# Altium schematic sheet FLIR LWIR.SchDoc
size A2
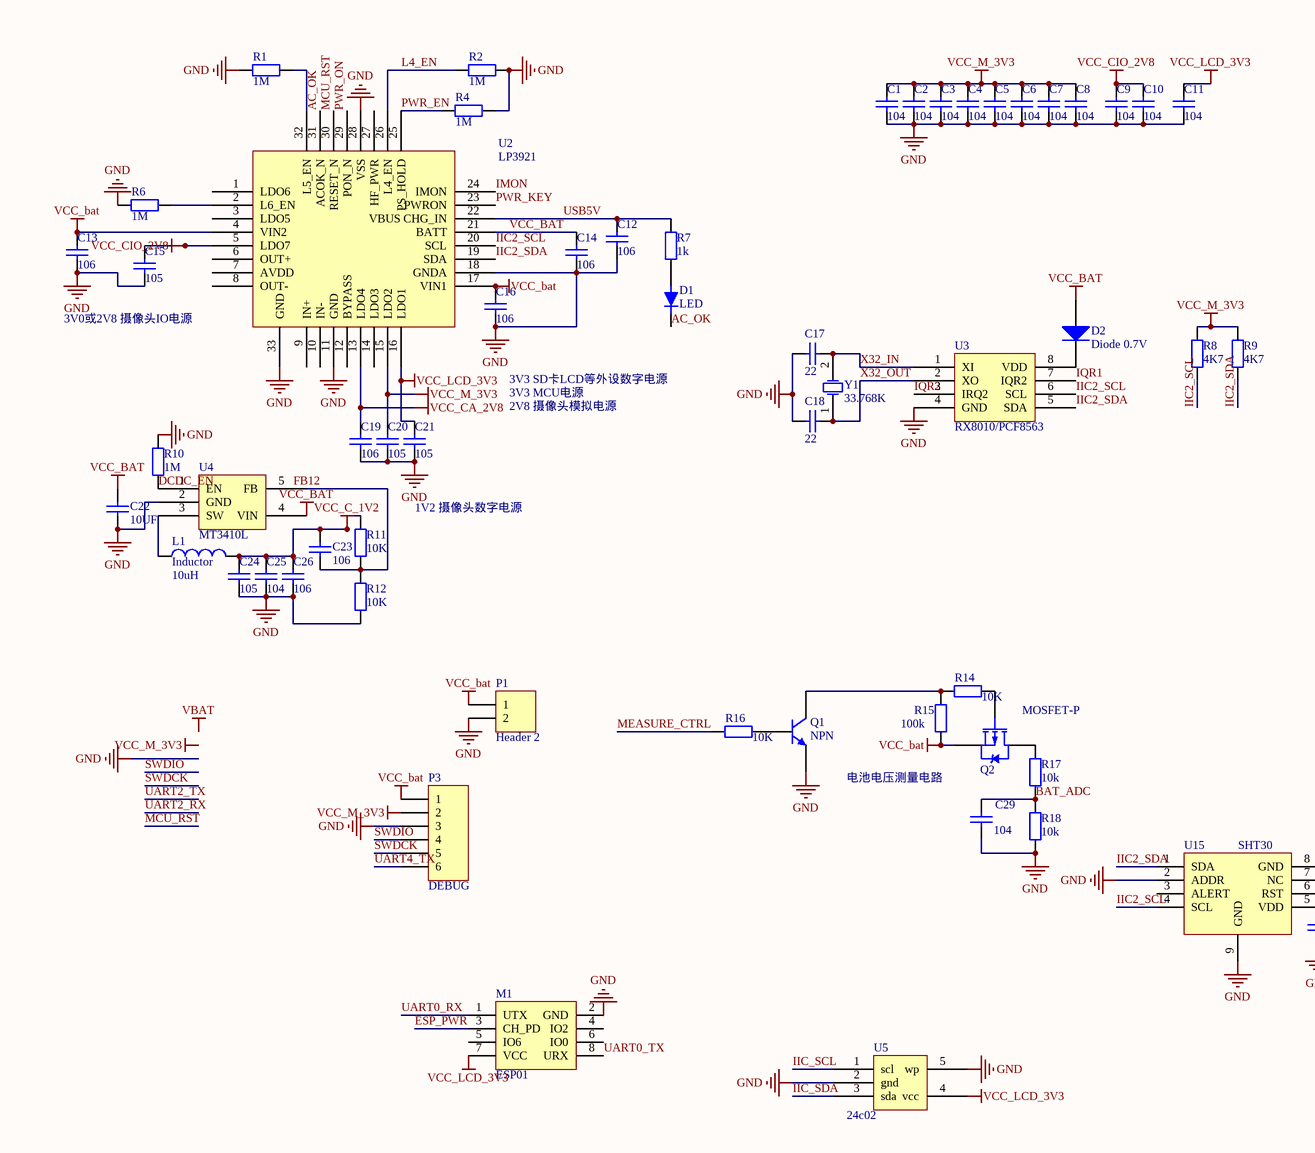
[diagram p0: FLIR LWIR.SchDoc, top left]
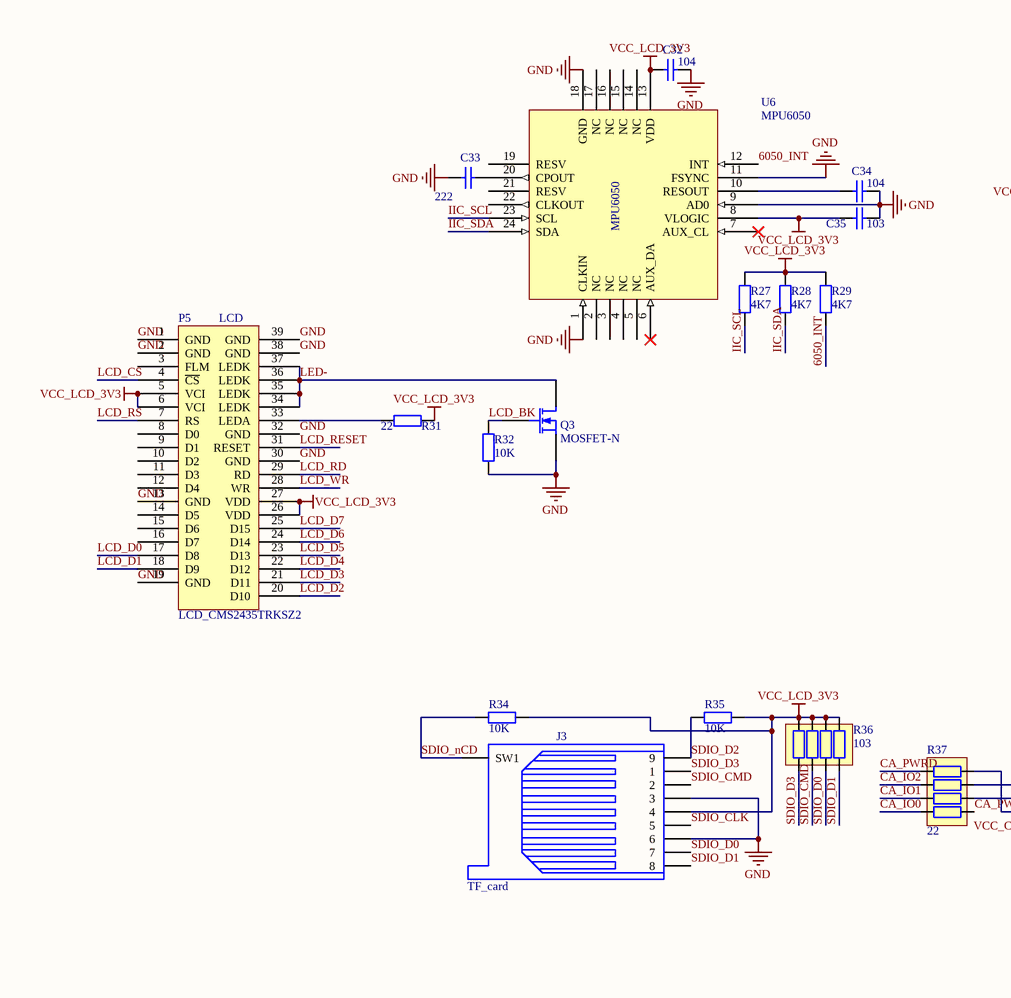
[diagram p1: FLIR LWIR.SchDoc, bottom left]
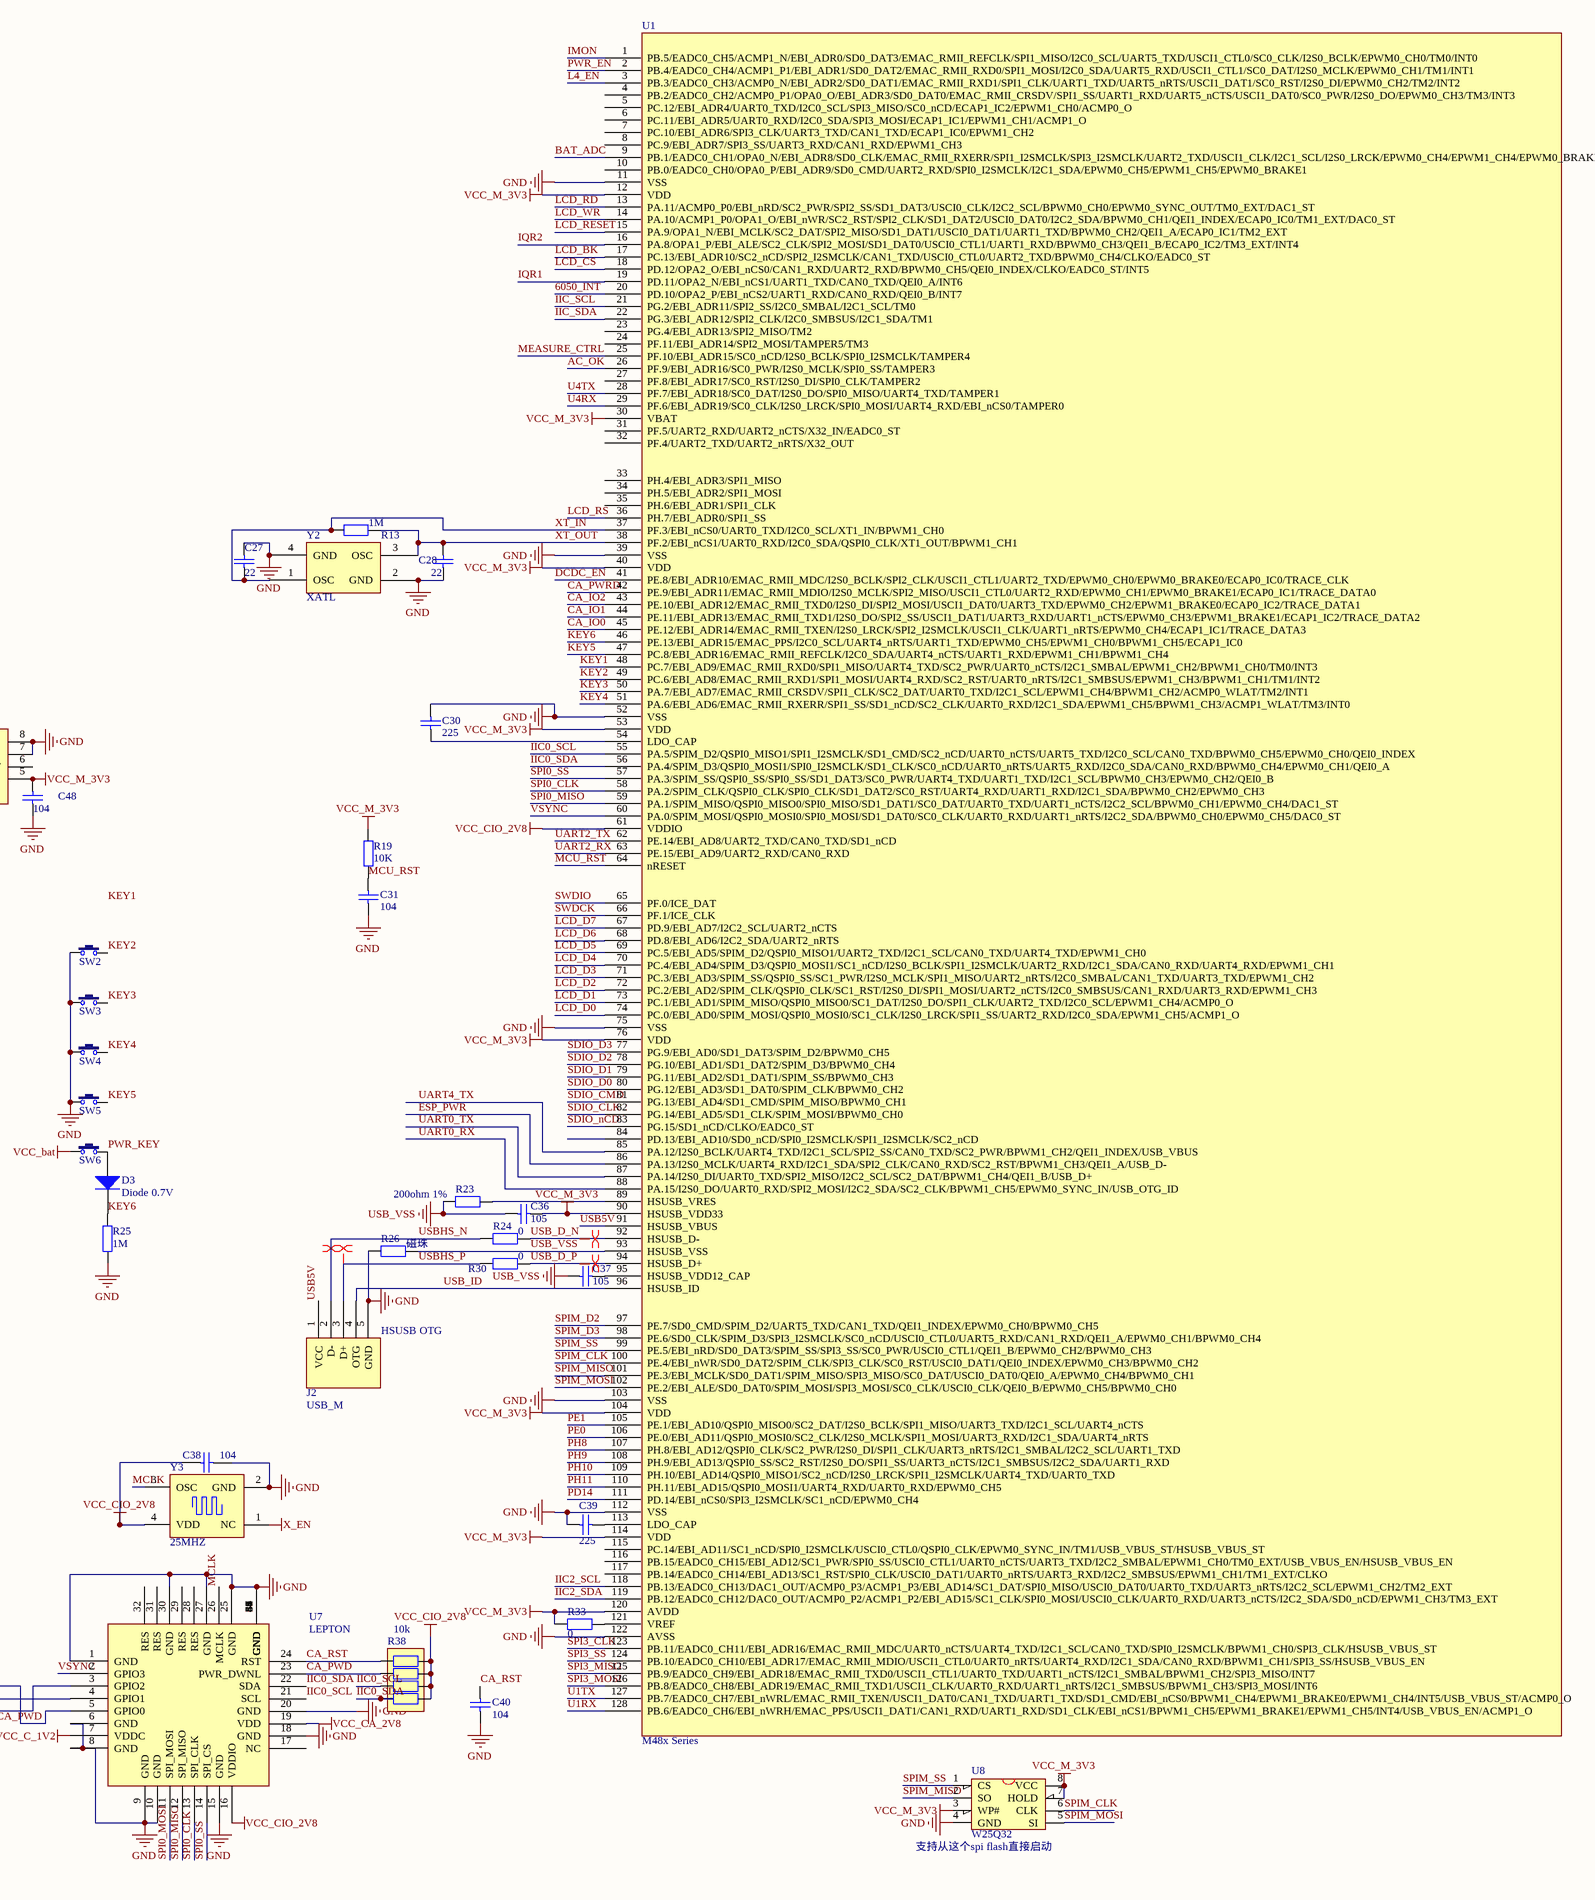
[diagram p2: FLIR LWIR.SchDoc, bottom right]

## Parts
C1  value 104  [my0603_C]  (hidden comment: Cap)
C2  value 104  [my0603_C]  (hidden comment: Cap)
C3  value 104  [my0603_C]  (hidden comment: Cap)
C4  value 104  [my0603_C]  (hidden comment: Cap)
C5  value 104  [my0603_C]  (hidden comment: Cap)
C6  value 104  [my0603_C]  (hidden comment: Cap)
C7  value 104  [my0603_C]  (hidden comment: Cap)
C8  value 104  [my0603_C]  (hidden comment: Cap)
C9  value 104  [my0603_C]  (hidden comment: Cap)
C10  value 104  [my0603_C]  (hidden comment: Cap)
C11  value 104  [my0603_C]  (hidden comment: Cap)
C12  value 106  [MY0805_C]  (hidden comment: Cap)
C13  value 106  [MY0805_C]  (hidden comment: Cap)
C14  value 106  [MY0805_C]  (hidden comment: Cap)
C15  value 105  [my0603_C]  (hidden comment: Cap)
C16  value 106  [MY0805_C]  (hidden comment: Cap)
C17  value 22  [my0603_C]  (hidden comment: Cap)
C18  value 22  [my0603_C]  (hidden comment: Cap)
C19  value 106  [MY0805_C]  (hidden comment: Cap)
C20  value 105  [my0603_C]  (hidden comment: Cap)
C21  value 105  [my0603_C]  (hidden comment: Cap)
C22  value 10UF  [my0805_c]  (hidden comment: Cap)
C23  value 106  [my0603_C]  (hidden comment: Cap)
C24  value 105  [my0603_C]  (hidden comment: Cap)
C25  value 104  [my0603_C]  (hidden comment: Cap)
C26  value 106  [MY0805_C]  (hidden comment: Cap)
C27  value 22  [my0603_C]  (hidden comment: Cap)
C28  value 22  [my0603_C]  (hidden comment: Cap)
C29  value 104  [MY0603_C]  (hidden comment: Cap)
C30  value 225  [6-0805_N]  (hidden comment: Cap)
C31  value 104  [my0603_C]  (hidden comment: Cap)
C32  value 104  [MY0603_c]  (hidden comment: Cap)
C33  value 222  [MY0603_c]  (hidden comment: Cap)
C34  value 104  [MY0603_c]  (hidden comment: Cap)
C35  value 103  [MY0603_c]  (hidden comment: Cap)
C36  value 105  [my0603_C]  (hidden comment: Cap)
C37  value 105  [my0603_C]  (hidden comment: Cap)
C38  104  [MY0603_C]
C39  value 225  [6-0805_N]  (hidden comment: Cap)
C40  value 104  [my0603_C]  (hidden comment: Cap)
C48  value 104  [my0603_C]  (hidden comment: Cap)
D1  LED  [SMDLED]
D2  Diode 0.7V  [6-0805_N]
D3  Diode 0.7V  [6-0805_N]
J2  USB_M  [USB_micro_沉板]
J3  TF_card  [TFCARD_完整二合一]
L1  Inductor  value 10uH  [L1210]
M1  ESP01  [HDR2X4]
P1  Header 2  [HDR1X2]
P3  DEBUG  [Header6]
P5  LCD_CMS2435TRKSZ2  [FH26-39S-0.3SHW外框]
Q1  NPN  [MY_SOT23_BJT]
Q2  MOSFET-P  [MY_SOT23_BJT]
Q3  MOSFET-N  [SOT23]
R1  value 1M  [my0603_R]  (hidden comment: Res2)
R2  value 1M  [my0603_R]  (hidden comment: Res2)
R4  value 1M  [my0603_R]  (hidden comment: Res2)
R6  value 1M  [my0603_R]  (hidden comment: Res2)
R7  value 1k  [MY0603_R]  (hidden comment: Res2)
R8  value 4K7  [my0603_R]  (hidden comment: Res2)
R9  value 4K7  [my0603_R]  (hidden comment: Res2)
R10  value 1M  [my0603_R]  (hidden comment: Res2)
R11  value 10K  [my0603_R]  (hidden comment: Res2)
R12  value 10K  [my0603_R]  (hidden comment: Res2)
R13  value 1M  [my0603_R]  (hidden comment: Res2)
R14  value 10K  [my0603_R]  (hidden comment: Res2)
R15  value 100k  [MY0603_R]  (hidden comment: Res2)
R16  value 10K  [my0603_R]  (hidden comment: Res2)
R17  value 10k  [MY0603_R]  (hidden comment: Res2)
R18  value 10k  [MY0603_R]  (hidden comment: Res2)
R19  value 10K  [my0603_R]  (hidden comment: Res2)
R23  value 200ohm 1%  [my0603_R]  (hidden comment: Res2)
R24  value 0  [my0603_R]  (hidden comment: Res2)
R25  value 1M  [my0603_R]  (hidden comment: Res2)
R26  value 磁珠  [my0603_R]  (hidden comment: Res2)
R27  value 4K7  [my0603_R]  (hidden comment: Res2)
R28  value 4K7  [my0603_R]  (hidden comment: Res2)
R29  value 4K7  [my0603_R]  (hidden comment: Res2)
R30  value 0  [my0603_R]  (hidden comment: Res2)
R31  value 22  [MY0603_R]  (hidden comment: Res2)
R32  value 10K  [MY0603_R]  (hidden comment: Res2)
R33  value 0  [MY0603_R]  (hidden comment: Res2)
R34  value 10K  [MY0603_R]  (hidden comment: Res2)
R35  value 10K  [MY0603_R]  (hidden comment: Res2)
R36  103  [RCA-8P4R-0603]
R37  22  [RCA-8P4R-0603]
R38  10k  [RCA-8P4R-0603]
SW2  3x6x5  [KEY_SMD_侧装大]  (value not drawn)
SW3  3x6x5  [KEY_SMD_侧装大]  (value not drawn)
SW4  3x6x5  [KEY_SMD_侧装大]  (value not drawn)
SW5  3x6x5  [KEY_SMD_侧装大]  (value not drawn)
SW6  3x6x5  [KEY_SMD_侧装大]  (value not drawn)
U1  M48x Series  [LQFP128S]
U2  LP3921  [QFN32]
U3  RX8010/PCF8563  [SOP8]
U4  MT3410L  [sot23-5]
U5  24c02  [sot23_5]
U6  MPU6050  [QFN24]
U7  LEPTON  [Molex,_105028-1001_1]
U8  W25Q32  [sop8-flash]
U15  SHT30  [SHT30_DFN8]
Y1  33.768K  [XATL-FC-135]
Y2  XATL  [X-253250]
Y3  25MHZ  [X-253250]

## Nets
GND: C1.1 C2.1 C3.1 C4.1 C5.1 C6.1 C7.1 C8.1 C9.1 C10.1 C11.1 C12.1 C13.1 C14.1 C15.1 C16.1 C17.2 C18.2 C19.1 C20.1 C21.1 C22.1 C24.1 C25.1 C26.1 C27.2 C28.1 C29.2 C30.1 C31.2 C32.1 C33.1 C34.1 C35.1 C38.2 C39.2 C40.2 C48.1 J2.5(GND) J3.3 J3.6 M1.2(GND) P1.2 P3.3 P5.1(GND) P5.2(GND) P5.13(GND) P5.19(GND) P5.30(GND) P5.32(GND) P5.38(GND) P5.39(GND) Q1.2(E) Q3.3(S) R1.2 R2.1 R4.1 R6.2 R10.2 R12.1 R18.1 R25.2 R26.1 R32.2 SW2.1 SW3.1 SW4.1 SW5.1 U1.11(VSS) U1.39(VSS) U1.52(VSS) U1.75(VSS) U1.103(VSS) U1.112(VSS) U1.122(AVSS) U2.11(GND) U2.18(GNDA) U2.28(VSS) U2.33(GND) U3.4(GND) U4.2(GND) U5.2(gnd) U5.5(wp) U6.1(CLKIN) U6.9(AD0) U6.11(FSYNC) U6.18(GND) U7.1(GND) U7.6(GND) U7.8(GND) U7.9(GND) U7.10(GND) U7.15(GND) U7.18(GND) U7.20(GND) U7.25(GND) U7.27(GND) U7.30(GND) U7.33(GND) U7.34(GND) U7.35(GND) U7.36(GND) U7.37(GND) U7.38(GND) U7.39(GND) U7.40(GND) U7.41(GND) U7.42(GND) U7.43(GND) U7.44(GND) U7.52(GND) U7.53(GND) U7.54(GND) U7.55(GND) U7.56(GND) U7.57(GND) U7.58(GND) U7.59(GND) U7.60(GND) U7.61(GND) U7.62(GND) U7.66(GND) U7.67(GND) U7.68(GND) U8.4(GND) U15.2(ADDR) U15.7(NC) U15.8(GND) U15.9(GND) Y2.2(GND) Y2.4(GND) Y3.2(GND)
USB_VSS: C36.1 C37.1 R23.1 R26.2 U1.93(HSUSB_VSS)
VCC_BAT: C13.2 C14.2 C16.2 C22.2 D2.1(A) P1.1 P3.1 Q2.2(S) R15.1 SW6.1 U2.4(VIN2) U2.17(VIN1) U2.21(BATT) U4.4(VIN)
VCC_C_1V2: C23.1 C24.2 C25.2 C26.2 L1.2 R11.2 U7.7(VDDC)
VCC_CA_2V8: C19.2 U2.13(LDO4) U7.19(VDD)
VCC_CIO_2V8: C9.2 C10.2 C15.2 C38.1 R38.5 R38.6 R38.7 R38.8 U1.61(VDDIO) U2.5(LDO7) U7.16(VDDIO) Y3.4(VDD)
VCC_LCD_3V3: C11.2 C21.2 C32.2 C35.2 J3.4 M1.7(VCC) P5.5(VCI) P5.6(VCI) P5.26(VDD) P5.27(VDD) R27.2 R28.1 R29.1 R31.1 R34.2 R35.2 R36.5 R36.6 R36.7 R36.8 U2.16(LDO1) U5.4(vcc) U6.8(VLOGIC) U6.13(VDD)
VCC_M_3V3: C1.2 C2.2 C3.2 C4.2 C5.2 C6.2 C7.2 C8.2 C20.2 C36.2 C48.2 P3.2 R8.2 R9.1 R19.2 R33.2 U1.12(VDD) U1.30(VBAT) U1.40(VDD) U1.53(VDD) U1.76(VDD) U1.90(HSUSB_VDD33) U1.104(VDD) U1.114(VDD) U1.120(AVDD) U2.15(LDO2) U8.3(WP#) U8.7(HOLD) U8.8(VCC) U15.5(VDD)
X_EN: Y3.1(NC)
6050_INT: R29.2 U1.20(PD.10/OPA2_P/EBI_nCS2/UART1_RXD/CAN0_RXD/QEI0_B/INT7) U6.12(INT)
AC_OK: D1.2(K) U1.26(PF.9/EBI_ADR16/SC0_PWR/I2S0_MCLK/SPI0_SS/TAMPER3) U2.31(ACOK_N)
BAT_ADC: C29.1 R17.1 R18.2 U1.9(PB.1/EADC0_CH1/OPA0_N/EBI_ADR8/SD0_CLK/EMAC_RMII_RXERR/SPI1_I2SMCLK/SPI3_I2SMCLK/UART2_TXD/USCI1_CLK/I2C1_SCL/I2S0_LRCK/EPWM0_CH4/EPWM1_CH4/EPWM0_BRAKE0)
CA_IO0: R37.1 U1.45(PE.12/EBI_ADR14/EMAC_RMII_TXEN/I2S0_LRCK/SPI2_I2SMCLK/USCI1_CLK/UART1_nRTS/EPWM0_CH4/ECAP1_IC1/TRACE_DATA3)
CA_IO1: R37.2 U1.44(PE.11/EBI_ADR13/EMAC_RMII_TXD1/I2S0_DO/SPI2_SS/USCI1_DAT1/UART3_RXD/UART1_nCTS/EPWM0_CH3/EPWM1_BRAKE1/ECAP1_IC2/TRACE_DATA2)
CA_IO2: R37.3 U1.43(PE.10/EBI_ADR12/EMAC_RMII_TXD0/I2S0_DI/SPI2_MOSI/USCI1_DAT0/UART3_TXD/EPWM0_CH2/EPWM1_BRAKE0/ECAP0_IC2/TRACE_DATA1)
CA_PWD: R37.8 R38.2 U7.23(PWR_DWNL)
CA_PWRD: R37.4 U1.42(PE.9/EBI_ADR11/EMAC_RMII_MDIO/I2S0_MCLK/SPI2_MISO/USCI1_CTL0/UART2_RXD/EPWM0_CH1/EPWM0_BRAKE1/ECAP0_IC1/TRACE_DATA0)
CA_RST: C40.1 R38.1 U7.24(RST)
DCDC_EN: R10.1 U1.41(PE.8/EBI_ADR10/EMAC_RMII_MDC/I2S0_BCLK/SPI2_CLK/USCI1_CTL1/UART2_TXD/EPWM0_CH0/EPWM0_BRAKE0/ECAP0_IC0/TRACE_CLK) U4.1(EN)
ESP_PWR: M1.3(CH_PD) U1.86(PA.13/I2S0_MCLK/UART4_RXD/I2C1_SDA/SPI2_CLK/CAN0_RXD/SC2_RST/BPWM1_CH3/QEI1_A/USB_D-)
IIC0_SCL: R38.3 U1.55(PA.5/SPIM_D2/QSPI0_MISO1/SPI1_I2SMCLK/SD1_CMD/SC2_nCD/UART0_nCTS/UART5_TXD/I2C0_SCL/CAN0_TXD/BPWM0_CH5/EPWM0_CH0/QEI0_INDEX) U7.21(SCL)
IIC0_SDA: R38.4 U1.56(PA.4/SPIM_D3/QSPI0_MOSI1/SPI0_I2SMCLK/SD1_CLK/SC0_nCD/UART0_nRTS/UART5_RXD/I2C0_SDA/CAN0_RXD/BPWM0_CH4/EPWM0_CH1/QEI0_A) U7.22(SDA)
IIC2_SCL: R8.1 U1.118(PB.13/EADC0_CH13/DAC1_OUT/ACMP0_P3/ACMP1_P3/EBI_AD14/SC1_DAT/SPI0_MISO/USCI0_DAT0/UART0_TXD/UART3_nRTS/I2C2_SCL/EPWM1_CH2/TM2_EXT) U2.20(SCL) U3.6(SCL) U15.4(SCL)
IIC2_SDA: R9.2 U1.119(PB.12/EADC0_CH12/DAC0_OUT/ACMP0_P2/ACMP1_P2/EBI_AD15/SC1_CLK/SPI0_MOSI/USCI0_CLK/UART0_RXD/UART3_nCTS/I2C2_SDA/SD0_nCD/EPWM1_CH3/TM3_EXT) U2.19(SDA) U3.5(SDA) U15.1(SDA)
IIC_SCL: R27.1 U1.21(PG.2/EBI_ADR11/SPI2_SS/I2C0_SMBAL/I2C1_SCL/TM0) U5.1(scl) U6.23(SCL)
IIC_SDA: R28.2 U1.22(PG.3/EBI_ADR12/SPI2_CLK/I2C0_SMBSUS/I2C1_SDA/TM1) U5.3(sda) U6.24(SDA)
IMON: U1.1(PB.5/EADC0_CH5/ACMP1_N/EBI_ADR0/SD0_DAT3/EMAC_RMII_REFCLK/SPI1_MISO/I2C0_SCL/UART5_TXD/USCI1_CTL0/SC0_CLK/I2S0_BCLK/EPWM0_CH0/TM0/INT0) U2.24(IMON)
IQR1: U1.19(PD.11/OPA2_N/EBI_nCS1/UART1_TXD/CAN0_TXD/QEI0_A/INT6) U3.7(IQR2)
IQR2: U1.16(PA.8/OPA1_P/EBI_ALE/SC2_CLK/SPI2_MOSI/SD1_DAT0/USCI0_CTL1/UART1_RXD/BPWM0_CH3/QEI1_B/ECAP0_IC2/TM3_EXT/INT4) U3.3(IRQ2)
KEY1: U1.48(PC.7/EBI_AD9/EMAC_RMII_RXD0/SPI1_MISO/UART4_TXD/SC2_PWR/UART0_nCTS/I2C1_SMBAL/EPWM1_CH2/BPWM1_CH0/TM0/INT3)
KEY2: SW2.2 U1.49(PC.6/EBI_AD8/EMAC_RMII_RXD1/SPI1_MOSI/UART4_RXD/SC2_RST/UART0_nRTS/I2C1_SMBSUS/EPWM1_CH3/BPWM1_CH1/TM1/INT2)
KEY3: SW3.2 U1.50(PA.7/EBI_AD7/EMAC_RMII_CRSDV/SPI1_CLK/SC2_DAT/UART0_TXD/I2C1_SCL/EPWM1_CH4/BPWM1_CH2/ACMP0_WLAT/TM2/INT1)
KEY4: SW4.2 U1.51(PA.6/EBI_AD6/EMAC_RMII_RXERR/SPI1_SS/SD1_nCD/SC2_CLK/UART0_RXD/I2C1_SDA/EPWM1_CH5/BPWM1_CH3/ACMP1_WLAT/TM3/INT0)
KEY5: SW5.2 U1.47(PC.8/EBI_ADR16/EMAC_RMII_REFCLK/I2C0_SDA/UART4_nCTS/UART1_RXD/EPWM1_CH1/BPWM1_CH4)
KEY6: D3.2(K) R25.1 U1.46(PE.13/EBI_ADR15/EMAC_PPS/I2C0_SCL/UART4_nRTS/UART1_TXD/EPWM0_CH5/EPWM1_CH0/BPWM1_CH5/ECAP1_IC0)
L4_EN: R2.2 U1.3(PB.3/EADC0_CH3/ACMP0_N/EBI_ADR2/SD0_DAT1/EMAC_RMII_RXD1/SPI1_CLK/UART1_TXD/UART5_nRTS/USCI1_DAT1/SC0_RST/I2S0_DI/EPWM0_CH2/TM2/INT2) U2.26(L4_EN)
LCD_BK: Q3.1(G) R32.1 U1.17(PC.13/EBI_ADR10/SC2_nCD/SPI2_I2SMCLK/CAN1_TXD/USCI0_CTL0/UART2_TXD/BPWM0_CH4/CLKO/EADC0_ST)
LCD_CS: P5.4(~{CS}) U1.18(PD.12/OPA2_O/EBI_nCS0/CAN1_RXD/UART2_RXD/BPWM0_CH5/QEI0_INDEX/CLKO/EADC0_ST/INT5)
LCD_D0: P5.17(D8) U1.74(PC.0/EBI_AD0/SPIM_MOSI/QSPI0_MOSI0/SC1_CLK/I2S0_LRCK/SPI1_SS/UART2_RXD/I2C0_SDA/EPWM1_CH5/ACMP1_O)
LCD_D1: P5.18(D9) U1.73(PC.1/EBI_AD1/SPIM_MISO/QSPI0_MISO0/SC1_DAT/I2S0_DO/SPI1_CLK/UART2_TXD/I2C0_SCL/EPWM1_CH4/ACMP0_O)
LCD_D2: P5.20(D10) U1.72(PC.2/EBI_AD2/SPIM_CLK/QSPI0_CLK/SC1_RST/I2S0_DI/SPI1_MOSI/UART2_nCTS/I2C0_SMBSUS/CAN1_RXD/UART3_RXD/EPWM1_CH3)
LCD_D3: P5.21(D11) U1.71(PC.3/EBI_AD3/SPIM_SS/QSPI0_SS/SC1_PWR/I2S0_MCLK/SPI1_MISO/UART2_nRTS/I2C0_SMBAL/CAN1_TXD/UART3_TXD/EPWM1_CH2)
LCD_D4: P5.22(D12) U1.70(PC.4/EBI_AD4/SPIM_D3/QSPI0_MOSI1/SC1_nCD/I2S0_BCLK/SPI1_I2SMCLK/UART2_RXD/I2C1_SDA/CAN0_RXD/UART4_RXD/EPWM1_CH1)
LCD_D5: P5.23(D13) U1.69(PC.5/EBI_AD5/SPIM_D2/QSPI0_MISO1/UART2_TXD/I2C1_SCL/CAN0_TXD/UART4_TXD/EPWM1_CH0)
LCD_D6: P5.24(D14) U1.68(PD.8/EBI_AD6/I2C2_SDA/UART2_nRTS)
LCD_D7: P5.25(D15) U1.67(PD.9/EBI_AD7/I2C2_SCL/UART2_nCTS)
LCD_RD: P5.29(RD) U1.13(PA.11/ACMP0_P0/EBI_nRD/SC2_PWR/SPI2_SS/SD1_DAT3/USCI0_CLK/I2C2_SCL/BPWM0_CH0/EPWM0_SYNC_OUT/TM0_EXT/DAC1_ST)
LCD_RESET: P5.31(RESET) U1.15(PA.9/OPA1_N/EBI_MCLK/SC2_DAT/SPI2_MISO/SD1_DAT1/USCI0_DAT1/UART1_TXD/BPWM0_CH2/QEI1_A/ECAP0_IC1/TM2_EXT)
LCD_RS: P5.7(RS) U1.36(PH.7/EBI_ADR0/SPI1_SS)
LCD_WR: P5.28(WR) U1.14(PA.10/ACMP1_P0/OPA1_O/EBI_nWR/SC2_RST/SPI2_CLK/SD1_DAT2/USCI0_DAT0/I2C2_SDA/BPWM0_CH1/QEI1_INDEX/ECAP0_IC0/TM1_EXT/DAC0_ST)
LED-: P5.34(LEDK) P5.35(LEDK) P5.36(LEDK) P5.37(LEDK) Q3.2(D)
MCLK: U7.26(MCLK) Y3.3(OSC)
MCU_RST: C31.1 R19.1 U1.64(nRESET) U2.30(RESET_N)
MEASURE_CTRL: R16.2 U1.25(PF.10/EBI_ADR15/SC0_nCD/I2S0_BCLK/SPI0_I2SMCLK/TAMPER4)
PD14: U1.111(PD.14/EBI_nCS0/SPI3_I2SMCLK/SC1_nCD/EPWM0_CH4)
PE0: U1.106(PE.0/EBI_AD11/QSPI0_MOSI0/SC2_CLK/I2S0_MCLK/SPI1_MOSI/UART3_RXD/I2C1_SDA/UART4_nRTS)
PE1: U1.105(PE.1/EBI_AD10/QSPI0_MISO0/SC2_DAT/I2S0_BCLK/SPI1_MISO/UART3_TXD/I2C1_SCL/UART4_nCTS)
PH8: U1.107(PH.8/EBI_AD12/QSPI0_CLK/SC2_PWR/I2S0_DI/SPI1_CLK/UART3_nRTS/I2C1_SMBAL/I2C2_SCL/UART1_TXD)
PH9: U1.108(PH.9/EBI_AD13/QSPI0_SS/SC2_RST/I2S0_DO/SPI1_SS/UART3_nCTS/I2C1_SMBSUS/I2C2_SDA/UART1_RXD)
PH10: U1.109(PH.10/EBI_AD14/QSPI0_MISO1/SC2_nCD/I2S0_LRCK/SPI1_I2SMCLK/UART4_TXD/UART0_TXD)
PH11: U1.110(PH.11/EBI_AD15/QSPI0_MOSI1/UART4_RXD/UART0_RXD/EPWM0_CH5)
PWR_EN: R4.2 U1.2(PB.4/EADC0_CH4/ACMP1_P1/EBI_ADR1/SD0_DAT2/EMAC_RMII_RXD0/SPI1_MOSI/I2C0_SDA/UART5_RXD/USCI1_CTL1/SC0_DAT/I2S0_MCLK/EPWM0_CH1/TM1/INT1) U2.25(PS_HOLD)
PWR_KEY: D3.1(A) SW6.2 U2.23(PWRON)
PWR_ON: U2.29(PON_N)
SDIO_CLK: J3.5 U1.82(PG.14/EBI_AD5/SD1_CLK/SPIM_MOSI/BPWM0_CH0)
SDIO_CMD: J3.2 R36.2 U1.81(PG.13/EBI_AD4/SD1_CMD/SPIM_MISO/BPWM0_CH1)
SDIO_D0: J3.7 R36.3 U1.80(PG.12/EBI_AD3/SD1_DAT0/SPIM_CLK/BPWM0_CH2)
SDIO_D1: J3.8 R36.4 U1.79(PG.11/EBI_AD2/SD1_DAT1/SPIM_SS/BPWM0_CH3)
SDIO_D2: J3.9 R35.1 U1.78(PG.10/EBI_AD1/SD1_DAT2/SPIM_D3/BPWM0_CH4)
SDIO_D3: J3.1 R36.1 U1.77(PG.9/EBI_AD0/SD1_DAT3/SPIM_D2/BPWM0_CH5)
SDIO_nCD: J3.10(SW1) R34.1 U1.83(PG.15/SD1_nCD/CLKO/EADC0_ST)
SPI0_CLK: U1.58(PA.2/SPIM_CLK/QSPI0_CLK/SPI0_CLK/SD1_DAT2/SC0_RST/UART4_RXD/UART1_RXD/I2C1_SDA/BPWM0_CH2/EPWM0_CH3) U7.13(SPI_CLK)
SPI0_MISO: U1.59(PA.1/SPIM_MISO/QSPI0_MISO0/SPI0_MISO/SD1_DAT1/SC0_DAT/UART0_TXD/UART1_nCTS/I2C2_SCL/BPWM0_CH1/EPWM0_CH4/DAC1_ST) U7.12(SPI_MISO)
SPI0_MOSI: U7.11(SPI_MOSI)
SPI0_SS: U1.57(PA.3/SPIM_SS/QSPI0_SS/SPI0_SS/SD1_DAT3/SC0_PWR/UART4_TXD/UART1_TXD/I2C1_SCL/BPWM0_CH3/EPWM0_CH2/QEI0_B) U7.14(SPI_CS)
SPI3_CLK: U1.123(PB.11/EADC0_CH11/EBI_ADR16/EMAC_RMII_MDC/UART0_nCTS/UART4_TXD/I2C1_SCL/CAN0_TXD/SPI0_I2SMCLK/BPWM1_CH0/SPI3_CLK/HSUSB_VBUS_ST)
SPI3_MISO: U1.125(PB.9/EADC0_CH9/EBI_ADR18/EMAC_RMII_TXD0/USCI1_CTL1/UART0_TXD/UART1_nCTS/I2C1_SMBAL/BPWM1_CH2/SPI3_MISO/INT7)
SPI3_MOSI: U1.126(PB.8/EADC0_CH8/EBI_ADR19/EMAC_RMII_TXD1/USCI1_CLK/UART0_RXD/UART1_nRTS/I2C1_SMBSUS/BPWM1_CH3/SPI3_MOSI/INT6)
SPI3_SS: U1.124(PB.10/EADC0_CH10/EBI_ADR17/EMAC_RMII_MDIO/USCI1_CTL0/UART0_nRTS/UART4_RXD/I2C1_SDA/CAN0_RXD/BPWM1_CH1/SPI3_SS/HSUSB_VBUS_EN)
SPIM_CLK: U1.100(PE.4/EBI_nWR/SD0_DAT2/SPIM_CLK/SPI3_CLK/SC0_RST/USCI0_DAT1/QEI0_INDEX/EPWM0_CH3/BPWM0_CH2) U8.6(CLK)
SPIM_D2: U1.97(PE.7/SD0_CMD/SPIM_D2/UART5_TXD/CAN1_TXD/QEI1_INDEX/EPWM0_CH0/BPWM0_CH5)
SPIM_D3: U1.98(PE.6/SD0_CLK/SPIM_D3/SPI3_I2SMCLK/SC0_nCD/USCI0_CTL0/UART5_RXD/CAN1_RXD/QEI1_A/EPWM0_CH1/BPWM0_CH4)
SPIM_MISO: U1.101(PE.3/EBI_MCLK/SD0_DAT1/SPIM_MISO/SPI3_MISO/SC0_DAT/USCI0_DAT0/QEI0_A/EPWM0_CH4/BPWM0_CH1) U8.2(SO)
SPIM_MOSI: U1.102(PE.2/EBI_ALE/SD0_DAT0/SPIM_MOSI/SPI3_MOSI/SC0_CLK/USCI0_CLK/QEI0_B/EPWM0_CH5/BPWM0_CH0) U8.5(SI)
SPIM_SS: U1.99(PE.5/EBI_nRD/SD0_DAT3/SPIM_SS/SPI3_SS/SC0_PWR/USCI0_CTL1/QEI1_B/EPWM0_CH2/BPWM0_CH3) U8.1(CS)
SWDCK: P3.5 U1.66(PF.1/ICE_CLK)
SWDIO: P3.4 U1.65(PF.0/ICE_DAT)
U1RX: U1.128(PB.6/EADC0_CH6/EBI_nWRH/EMAC_PPS/USCI1_DAT1/CAN1_RXD/UART1_RXD/SD1_CLK/EBI_nCS1/BPWM1_CH5/EPWM1_BRAKE1/EPWM1_CH5/INT4/USB_VBUS_EN/ACMP1_O)
U1TX: U1.127(PB.7/EADC0_CH7/EBI_nWRL/EMAC_RMII_TXEN/USCI1_DAT0/CAN1_TXD/UART1_TXD/SD1_CMD/EBI_nCS0/BPWM1_CH4/EPWM1_BRAKE0/EPWM1_CH4/INT5/USB_VBUS_ST/ACMP0_O)
U4RX: U1.29(PF.6/EBI_ADR19/SC0_CLK/I2S0_LRCK/SPI0_MOSI/UART4_RXD/EBI_nCS0/TAMPER0)
U4TX: U1.28(PF.7/EBI_ADR18/SC0_DAT/I2S0_DO/SPI0_MISO/UART4_TXD/TAMPER1)
UART0_RX: M1.1(UTX) U1.88(PA.15/I2S0_DO/UART0_RXD/SPI2_MOSI/I2C2_SDA/SC2_CLK/BPWM1_CH5/EPWM0_SYNC_IN/USB_OTG_ID)
UART0_TX: M1.8(URX) U1.87(PA.14/I2S0_DI/UART0_TXD/SPI2_MISO/I2C2_SCL/SC2_DAT/BPWM1_CH4/QEI1_B/USB_D+)
UART2_RX: U1.63(PE.15/EBI_AD9/UART2_RXD/CAN0_RXD)
UART2_TX: U1.62(PE.14/EBI_AD8/UART2_TXD/CAN0_TXD/SD1_nCD)
UART4_TX: P3.6 U1.85(PA.12/I2S0_BCLK/UART4_TXD/I2C1_SCL/SPI2_SS/CAN0_TXD/SC2_PWR/BPWM1_CH2/QEI1_INDEX/USB_VBUS)
USB5V: C12.2 J2.1(VCC) R7.2 U1.91(HSUSB_VBUS) U2.22(VBUS_CHG_IN)
USB_D_N: R24.2 U1.92(HSUSB_D-)
USB_D_P: R30.2 U1.94(HSUSB_D+)
USB_ID: J2.4(OTG) U1.96(HSUSB_ID)
USBHS_N: J2.2(D-) R24.1
USBHS_P: J2.3(D+) R30.1
VSYNC: U1.60(PA.0/SPIM_MOSI/QSPI0_MOSI0/SPI0_MOSI/SD1_DAT0/SC0_CLK/UART0_RXD/UART1_nRTS/I2C2_SDA/BPWM0_CH0/EPWM0_CH5/DAC0_ST) U7.2(GPIO3)
X32_IN: C17.1 U3.1(XI) Y1.2(OSC2)
X32_OUT: C18.1 U3.2(XO) Y1.1(OSC1)
XT_IN: C27.1 R13.1 U1.37(PF.3/EBI_nCS0/UART0_TXD/I2C0_SCL/XT1_IN/BPWM1_CH0) Y2.1(OSC)
XT_OUT: C28.2 R13.2 U1.38(PF.2/EBI_nCS1/UART0_RXD/I2C0_SDA/QSPI0_CLK/XT1_OUT/BPWM1_CH1) Y2.3(OSC)
NetC23_2: C23.2 R11.1 R12.2 U4.5(FB)
NetC30_2: C30.2 U1.54(LDO_CAP)
NetC33_2: C33.2 U6.20(CPOUT)
NetC34_2: C34.2 U6.10(RESOUT)
NetC37_2: C37.2 U1.95(HSUSB_VDD12_CAP)
NetC39_1: C39.1 U1.113(LDO_CAP)
NetD1_1: D1.1(A) R7.1
NetD2_2: D2.2(K) U3.8(VDD)
NetL1_1: L1.1 U4.3(SW)
NetP5_33: P5.33(LEDA) R31.2
NetQ1_1: Q1.1(B) R16.1
NetQ1_3: Q1.3(C) R14.2 R15.2
NetQ2_1: Q2.1(G) R14.1
NetQ2_3: Q2.3(D) R17.2
NetR1_1: R1.1 U2.32(L5_EN)
NetR6_1: R6.1 U2.2(L6_EN)
NetR23_2: R23.2 U1.89(HSUSB_VRES)
NetR33_1: R33.1 U1.121(VREF)
NetR37_5: R37.5 U7.5(GPIO0)
NetR37_6: R37.6 U7.4(GPIO1)
NetR37_7: R37.7 U7.3(GPIO2)

Not connected (* = marked no-connect by the designer): M1 4(IO2) 5(IO6) 6(IO0); P5 3(FLM) 8(D0) 9(D1) 10(D2) 11(D3) 12(D4) 14(D5) 15(D6) 16(D7); U1 4(PB.2/EADC0_CH2/ACMP0_P1/OPA0_O/EBI_ADR3/SD0_DAT0/EMAC_RMII_CRSDV/SPI1_SS/UART1_RXD/UART5_nCTS/USCI1_DAT0/SC0_PWR/I2S0_DO/EPWM0_CH3/TM3/INT3) 5(PC.12/EBI_ADR4/UART0_TXD/I2C0_SCL/SPI3_MISO/SC0_nCD/ECAP1_IC2/EPWM1_CH0/ACMP0_O) 6(PC.11/EBI_ADR5/UART0_RXD/I2C0_SDA/SPI3_MOSI/ECAP1_IC1/EPWM1_CH1/ACMP1_O) 7(PC.10/EBI_ADR6/SPI3_CLK/UART3_TXD/CAN1_TXD/ECAP1_IC0/EPWM1_CH2) 8(PC.9/EBI_ADR7/SPI3_SS/UART3_RXD/CAN1_RXD/EPWM1_CH3) 10(PB.0/EADC0_CH0/OPA0_P/EBI_ADR9/SD0_CMD/UART2_RXD/SPI0_I2SMCLK/I2C1_SDA/EPWM0_CH5/EPWM1_CH5/EPWM0_BRAKE1) 23(PG.4/EBI_ADR13/SPI2_MISO/TM2) 24(PF.11/EBI_ADR14/SPI2_MOSI/TAMPER5/TM3) 27(PF.8/EBI_ADR17/SC0_RST/I2S0_DI/SPI0_CLK/TAMPER2) 31(PF.5/UART2_RXD/UART2_nCTS/X32_IN/EADC0_ST) 32(PF.4/UART2_TXD/UART2_nRTS/X32_OUT) 33(PH.4/EBI_ADR3/SPI1_MISO) 34(PH.5/EBI_ADR2/SPI1_MOSI) 35(PH.6/EBI_ADR1/SPI1_CLK) 84(PD.13/EBI_AD10/SD0_nCD/SPI0_I2SMCLK/SPI1_I2SMCLK/SC2_nCD) 115(PC.14/EBI_AD11/SC1_nCD/SPI0_I2SMCLK/USCI0_CTL0/QSPI0_CLK/EPWM0_SYNC_IN/TM1/USB_VBUS_ST/HSUSB_VBUS_ST) 116(PB.15/EADC0_CH15/EBI_AD12/SC1_PWR/SPI0_SS/USCI0_CTL1/UART0_nCTS/UART3_TXD/I2C2_SMBAL/EPWM1_CH0/TM0_EXT/USB_VBUS_EN/HSUSB_VBUS_EN) 117(PB.14/EADC0_CH14/EBI_AD13/SC1_RST/SPI0_CLK/USCI0_DAT1/UART0_nRTS/UART3_RXD/I2C2_SMBSUS/EPWM1_CH1/TM1_EXT/CLKO); U2 1(LDO6) 3(LDO5) 6(OUT+) 7(AVDD) 8(OUT-) 9(IN+) 10(IN-) 12(BYPASS) 14(LDO3) 27(HF_PWR); U6 2(NC) 3(NC) 4(NC) 5(NC) 6(AUX_DA)* 7(AUX_CL)* 14(NC) 15(NC) 16(NC) 17(NC) 19(RESV) 21(RESV) 22(CLKOUT); U7 17(NC) 28(RES) 29(RES) 31(RES) 32(RES); U15 3(ALERT) 6(RST)

## Layout directives
differential pair: USB_D_N, USB_D_P, USBHS_N, USBHS_P

## Notes on the sheet
- 3V0或2V8 摄像头IO电源
- 2V8 摄像头模拟电源
- 3V3 SD卡LCD等外设数字电源
- 3V3 MCU电源
- 1V2 摄像头数字电源
- 电池电压测量电路
- (near P5) LCD
- (near J2) HSUSB OTG
- (near U8) 支持从这个spi flash直接启动
- Labels drawn without touching a wire or pin: FB12, KEY1, VBAT, VCC_M_3V3

## Library data of the parts
C1-C37 C39 C40 C48 = Cap: Capacitor; Published: 8-Jun-2000; LatestRevisionDate: 17-Jul-2002; LatestRevisionNote: Re-released for DXP Platform.; PackageReference: RAD-0.3; Publisher: Altium Limited; PackageDescription: Radial Cap, Thru-Hole; 2 Leads; 0.3 in Pin Spacing
C38 = Cap Chip 2: Chip Capacitor, Silkscreen Border; Voltage: 63V; Tolerance: Y5V; Published: 8-Jun-2000; Revision: July-2002: Re-released for DXP Platform.; Publisher: Altium Limited; Price(RMB): 0.000; Value: 104
D1 = Diode LED: High Conductance Fast Diode; Published: 8-Jun-2000; LatestRevisionDate: 17-Jul-2002; LatestRevisionNote: Re-released for DXP Platform.; DatasheetVersion: 1997; PackageReference: DO-35; Publisher: Altium Limited; Code_JEDEC: DO-204-AH; ComponentLink1Description: Manufacturer Link; ComponentLink1URL: http://www.fairchildsemi.com/; ComponentLink2Description: Datasheet; ComponentLink2URL: http://www.fairchildsemi.com/ds/1N%2F1N4148.pdf
D2 D3 = Diode: Default Diode; Published: 8-Jun-2000; LatestRevisionDate: 17-Jul-2002; LatestRevisionNote: Re-released for DXP Platform.; PackageVersion: Sep-1996; PackageReference: SMC; Publisher: Altium Limited; PackageDescription: DO-214-AB/SMC; 2 C-Bend Leads; Body 7.9 x 5.9 mm, inc. leads (LxW); Code_JEDEC: DO-214-AB
J3 = sd_card
L1 = Inductor: Code_IEC: 1005; Published: 8-Jun-2000; LatestRevisionDate: 29-May-2009; LatestRevisionNote: IPC-7351 Footprint Added.; PackageReference: 0402-A; Publisher: Altium Limited; PackageDescription: Chip Inductor; Code_JEITA: 0402
M1 = ESP01: ESP01 ESP8266
P1 = Header 2: Header, 2-Pin; LatestRevisionDate: 17-Jul-2002; LatestRevisionNote: Re-released for DXP Platform.; Publisher: Altium Limited
P3 = Header 6: Header, 6-Pin; LatestRevisionDate: 17-Jul-2002; LatestRevisionNote: Re-released for DXP Platform.; Publisher: Altium Limited
Q1 = NPN_SOT23: NPN Bipolar Transistor; Published: 8-Jun-2000; LatestRevisionDate: 17-Jul-2002; LatestRevisionNote: Re-released for DXP Platform.; PackageReference: SOT23; Publisher: Altium Limited; PackageDescription: TO, Flat Index; 3 In-Line, Axial Leads; Body Dia. 4.8mm; Leads 0.55 x 0.51 mm (max); Code_JEDEC: SOT23
Q2 = MOSFET-P_SOT23: P-Channel MOSFET; Published: 8-Jun-2000; LatestRevisionDate: 17-Jul-2002; LatestRevisionNote: Re-released for DXP Platform.; PackageVersion: 1995/1996; PackageReference: SOT23; Publisher: Altium Limited; PackageDescription: SOT23
Q3 = MOSFET-N: N-Channel MOSFET; Published: 8-Jun-2000; LatestRevisionDate: 17-Jul-2002; LatestRevisionNote: Re-released for DXP Platform.; PackageVersion: 1995/1996; PackageReference: E3; Publisher: Altium Limited; PackageDescription: TO, Flat Index; 3 In-Line, Axial Leads; Body Dia. 4.6mm; Lead Dia. 0.5 mm (max)
R1 R2 R4 R6-R19 R23-R35 = Res2: Resistor; Published: 8-Jun-2000; LatestRevisionDate: 17-Jul-2002; LatestRevisionNote: Re-released for DXP Platform.; PackageReference: AXIAL-0.4; Publisher: Altium Limited; PackageDescription: Axial Device, Thru-Hole; 2 Leads; 0.4 in Pin Spacing
R36-R38 = R-8P4R: 贴片网络排阻; 版权归属: 源创客; BOM名称: 贴片网络排阻; 学习资源: www.ooocke.com
SW2-SW6 = TSW 3x6: 3x6轻触开关; 版权归属: 源创客; BOM名称: 3x6轻触开关; 学习资源: www.ooocke.com
U1 = Nuvoton M48x Series 复用: Nuvoton M48x Series
U5 = Component_1
U7 = LEPTON: FLIR LEPTON LWIR
U8 = W25X16: W25X16;SST25VF016;MX25L1605
Y1 = 晶振
Y2 = 晶振: 5032晶振
Y3 = XTAL1